# EAGLE design M_C_ext_main (EAGLE 9.6.2)
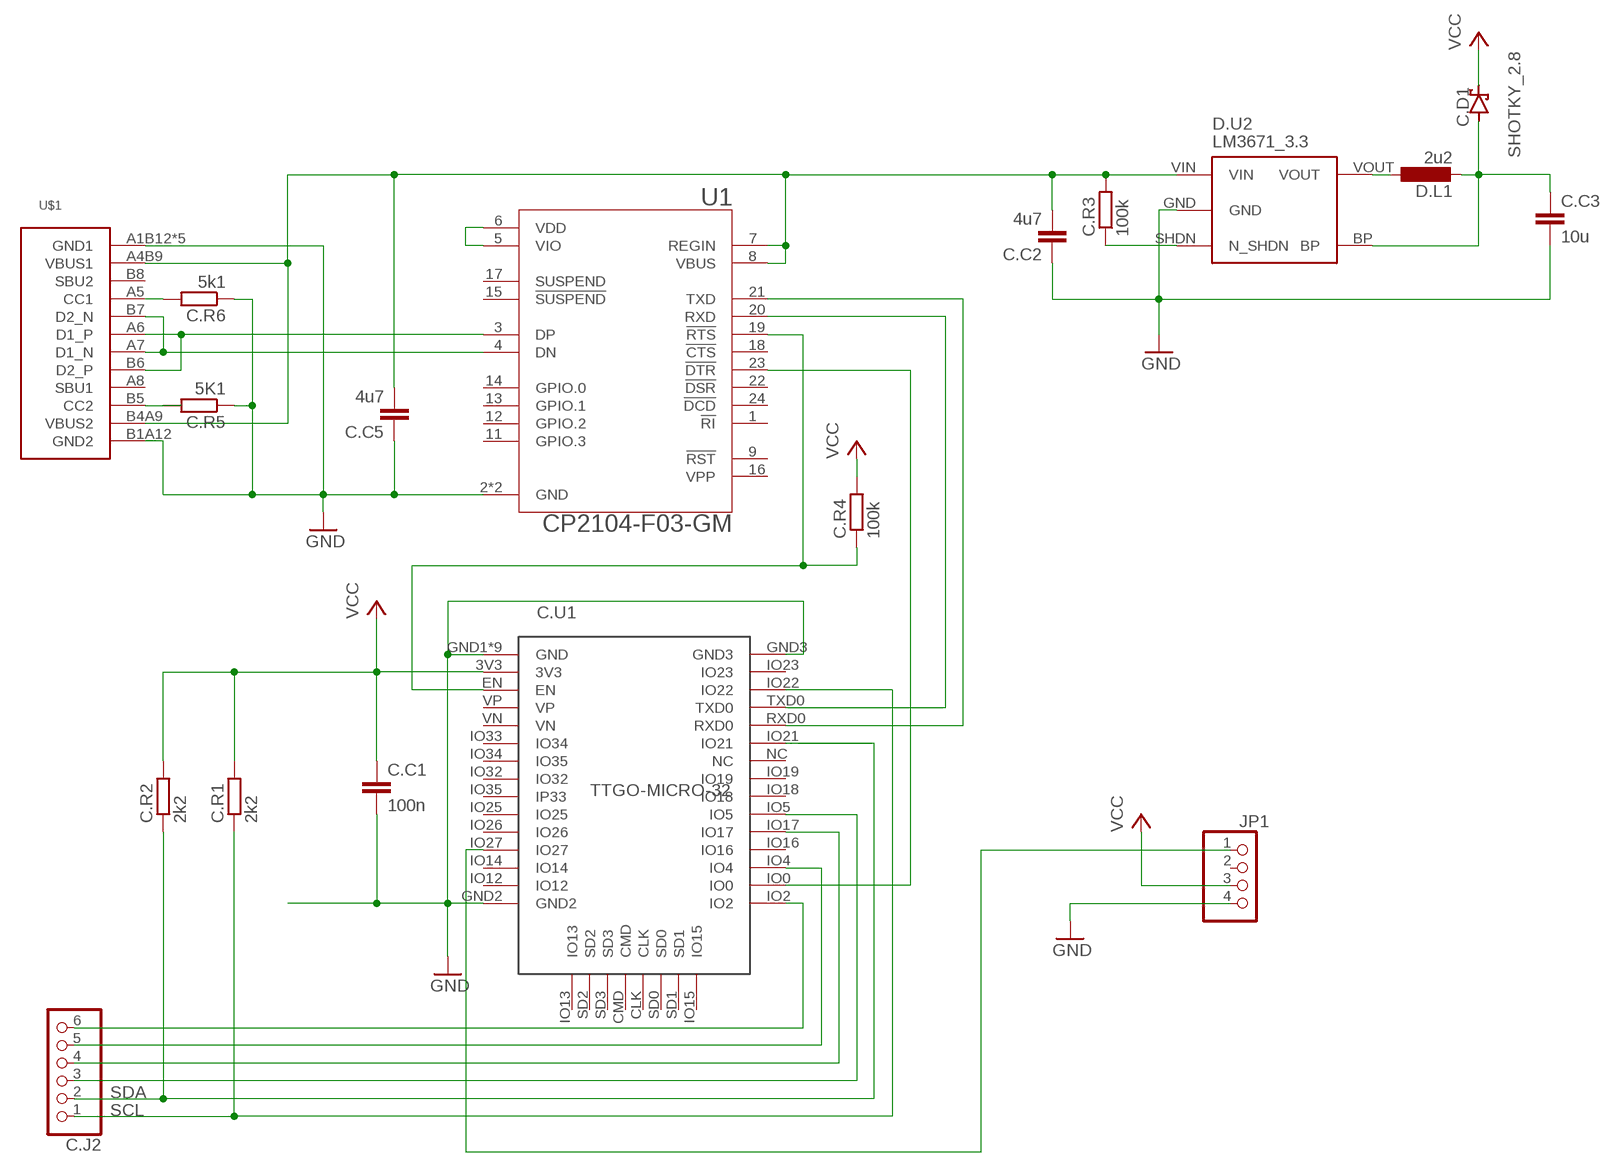
[diagram p0: schematic, sheet 1]

## Parts
C.C1  100n  C-EUC0603  [C0603]
C.C2  4u7  C-EUC0603  [C0603]
C.C3  10u  C-EUC0805  [C0805]
C.C5  4u7  C-EUC0603  [C0603]
C.D1  SHOTKY_2.8  [SHOTKY_2.8]
C.J2  PINHD-1X6  [1X06]
C.R1  2k2  R-EU_R0603  [R0603]
C.R2  2k2  R-EU_R0603  [R0603]
C.R3  100k  R-EU_R0603  [R0603]
C.R4  100k  R-EU_R0603  [R0603]
C.R5  5K1  R-EU_R0603  [R0603]
C.R6  5k1  R-EU_R0603  [R0603]
C.U1  TTGO-MICRO-32  [TTGO-MICRO-32]
D.L1  2u2  L-EUL3230M  [L3230M]
D.U2  LM3671_3.3  STABILISER_APE8865  [SOT32-5]
JP1  PINHD-1X4  [1X04]
U1  CP2104-F03-GM  [QFN50P400X400X80-25N]
U$1  USB-C  [USB-C]

## Nets
GND: C.C1.2 C.C2.1 C.C3.2 C.C5.1 C.R5.1 C.R6.1 C.U1.GND1(GND) C.U1.GND2 C.U1.GND3 C.U1.GND4(GND) C.U1.GND5(GND) C.U1.GND6(GND) C.U1.GND7(GND) C.U1.GND8(GND) C.U1.GND9(GND) C.U1.GND10(GND) C.U1.GND11(GND) D.U2.GND JP1.4 U1.2(GND) U1.25(GND) U$1.A1B12(GND1) U$1.B1A12(GND2) U$1.SH1(GND1) U$1.SH2(GND1) U$1.SH3(GND1) U$1.SH4(GND1)
N$1: U1.4(DN) U$1.A7(D1_N) U$1.B7(D2_N)
N$2: U1.3(DP) U$1.A6(D1_P) U$1.B6(D2_P)
N$3: C.R6.2 U$1.A5(CC1)
N$4: C.R5.2 U$1.B5(CC2)
N$5: C.C3.1 C.D1.A D.L1.2 D.U2.BP
N$6: C.J2.6 C.U1.IO2
N$8: U1.5(VIO) U1.6(VDD)
N$10: D.L1.1 D.U2.VOUT
N$11: C.R3.1 D.U2.SHDN(N_SHDN)
N$12: C.J2.5 C.U1.IO4
N$13: C.J2.4 C.U1.IO17
N$14: C.J2.3 C.U1.IO5
N$15: C.U1.IO27 JP1.1
PROG: C.U1.IO0 U1.23(!DTR)
RESET: C.R4.1 C.U1.EN U1.19(!RTS)
RX: C.U1.TXD0 U1.20(RXD)
SCL: C.J2.1 C.R1.1 C.U1.IO22
SDA: C.J2.2 C.R2.1 C.U1.IO21
TX: C.U1.RXD0 U1.21(TXD)
VCC: C.C1.1 C.D1.K(C) C.R1.2 C.R2.2 C.R4.2 C.U1.3V3 JP1.3
VUSB: C.C2.2 C.C5.2 C.R3.2 D.U2.VIN U1.7(REGIN) U1.8(VBUS) U$1.A4B9(VBUS1) U$1.B4A9(VBUS2)
Unconnected: C.U1.CLK C.U1.CMD C.U1.IO12 C.U1.IO13 C.U1.IO14 C.U1.IO15 C.U1.IO16 C.U1.IO18 C.U1.IO19 C.U1.IO23 C.U1.IO25 C.U1.IO26 C.U1.IO32 C.U1.IO33(IO34) C.U1.IO34(IO35) C.U1.IO35(IP33) C.U1.NC C.U1.SD0 C.U1.SD1 C.U1.SD2 C.U1.SD3 C.U1.VN C.U1.VP JP1.2 U1.1(!RI) U1.9(!RST!) U1.11(GPIO.3) U1.12(GPIO.2) U1.13(GPIO.1) U1.14(GPIO.0) U1.15(!SUSPEND!) U1.16(VPP) U1.17(SUSPEND) U1.18(!CTS) U1.22(!DSR) U1.24(!DCD) U$1.A8(SBU1) U$1.B8(SBU2)

## Library data of the parts
C.C1-C.C3 C.C5 = rcl:C-EU: CAPACITOR, European symbol; SPICEPREFIX: C
C.D1 = hugo:SHOTKY_2.8
C.J2 = pinhead2:PINHD-1X6: PIN HEADER
C.R1-C.R6 = rcl:R-EU_: RESISTOR, European symbol; SPICEPREFIX: R
C.U1 = hugo:TTGO-MICRO-32
D.L1 = rcl:L-EU: INDUCTOR, European symbol; SPICEPREFIX: L
D.U2 = !stavebnice03:STABILISER_APE8865
JP1 = pinhead2:PINHD-1X4: PIN HEADER
U1 = CP2104:CP2104: Silabs CP2104 USB to UART Bridge; AVAILABILITY: Unavailable; DESCRIPTION: USB Bridge, USB to UART USB 2.0 UART Interface 24-QFN (4x4); MF: Silicon Labs; MP: CP2104; PACKAGE: QFN-24 Silicon Labs; PRICE: None
U$1 = hugo:USB-C

## Board
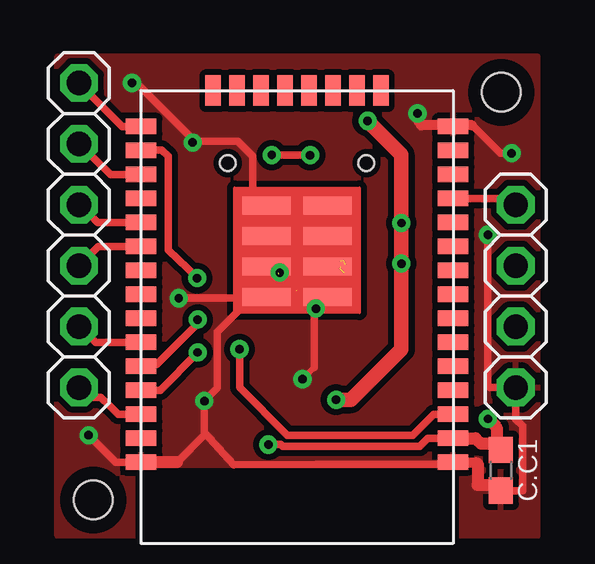
[diagram p1: board, top side]
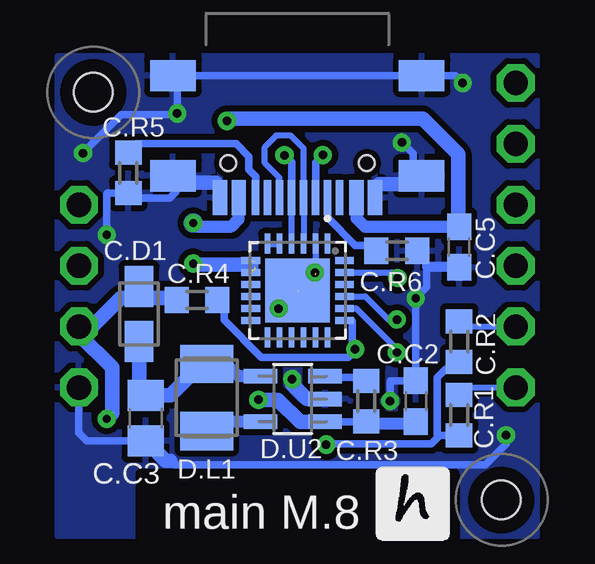
[diagram p2: board, bottom side, seen from below]

No outline drawn. Coordinates in mm, seen from the top.
Copper layers (1*16): Top 0.035mm / dielectric 1.5mm / Bottom 0.035mm
Design rules "default *": minimum track width 10mil, minimum drill 0.35mm, track to track 6mil, track to pad 6mil, pad to pad 6mil, via to via 10mil, smd to smd 10mil, copper to edge 10mil, drill to drill 40mil, minimum pad ring 10mil, minimum via ring 8mil, stop-mask expansion 4mil, vias tented up to drill 0mil, thermal gap 10mil
Holes 1.6 mm at 2,2 19,19
tRestrict: area 18,18 to 20,20; area 1,1 to 3,3
bRestrict: area 1,1 to 3,3; area 18,18 to 20,20

### Footprints (pad centres in the part's own frame; a part is rotated, then mirrored left to right if it is on the bottom)
C0603 = smd 1.1 x 1: 1 -0.85,0; 2 0.85,0
C0805 = smd 1.3 x 1.5: 1 -0.95,0; 2 0.95,0
SHOTKY_2.8 = smd 1.7 x 1.2: A -1.15,0; K 1.15,0
1X06 = drill 1.016 pad 1.575 octagon: 1 -6.35,0; 2 -3.81,0; 3 -1.27,0; 4 1.27,0; 5 3.81,0; 6 6.35,0
R0603 = smd 1 x 1.1: 1 -0.85,0; 2 0.85,0
TTGO-MICRO-32 = smd 1.27 x 0.635: 3V3 -6.5,5; EN -6.5,4; GND1 -6.5,6; GND2 -6.5,-8; GND3 6.5,6; IO0 6.5,-7; IO2 6.5,-8; IO4 6.5,-6; IO5 6.5,-3; IO12 -6.5,-7; IO14 -6.5,-6; IO16 6.5,-5; IO17 6.5,-4; IO18 6.5,-2; IO19 6.5,-1; IO21 6.5,1; IO22 6.5,4; IO23 6.5,5; IO25 -6.5,-3; IO26 -6.5,-4; IO27 -6.5,-5; IO32 -6.5,-1; IO33 -6.5,-2; IO34 -6.5,1; IO35 -6.5,0; NC 6.5,0; RXD0 6.5,2; TXD0 6.5,3; VN -6.5,2; VP -6.5,3 | smd 0.635 x 1.27: CLK 0.5,-9.5; CMD -0.5,-9.5; IO13 -3.5,-9.5; IO15 3.5,-9.5; SD0 1.5,-9.5; SD1 2.5,-9.5; SD2 -2.5,-9.5; SD3 -1.5,-9.5 | smd 2.032 x 0.762: GND4 -1.27,-0.889; GND5 1.27,-0.889; GND6 -1.27,-2.159; GND7 1.27,-2.159; GND8 -1.27,-3.429; GND9 -1.27,-4.699; GND10 1.27,-3.429; GND11 1.27,-4.699
L3230M = smd 1.6 x 2.2: 1 -1.4,0; 2 1.4,0
SOT32-5 = smd 0.6 x 1.4: BP 0.95,1.35; GND 0,-1.35; SHDN 0.95,-1.35; VIN -0.95,-1.35; VOUT -0.95,1.35
1X04 = drill 1.016 pad 1.575 octagon: 1 -3.81,0; 2 -1.27,0; 3 1.27,0; 4 3.81,0
QFN50P400X400X80-25N = smd 0.81 x 0.26: 1 -1.955,1.25; 2 -1.955,0.75; 3 -1.955,0.25; 4 -1.955,-0.25; 5 -1.955,-0.75; 6 -1.955,-1.25; 13 1.955,-1.25; 14 1.955,-0.75; 15 1.955,-0.25; 16 1.955,0.25; 17 1.955,0.75; 18 1.955,1.25 | smd 0.26 x 0.81: 7 -1.25,-1.955; 8 -0.75,-1.955; 9 -0.25,-1.955; 10 0.25,-1.955; 11 0.75,-1.955; 12 1.25,-1.955; 19 1.25,1.955; 20 0.75,1.955; 21 0.25,1.955; 22 -0.25,1.955; 23 -0.75,1.955; 24 -1.25,1.955 | smd 2.68 x 2.68: 25 0,0
USB-C = smd 0.6 x 1.45: A1B12 -3.235,3.825; A4B9 -2.46,3.825; B1A12 3.215,3.825; B4A9 2.44,3.825 | smd 0.3 x 1.45: A5 -1.26,3.825; A6 -0.26,3.825; A7 0.24,3.825; A8 1.24,3.825; B5 1.74,3.825; B6 0.74,3.825; B7 -0.76,3.825; B8 -1.76,3.825 | smd 1.9 x 1.3: SH1 -5.18,2.91; SH2 -5.18,-1.27; SH3 5.18,-1.27; SH4 5.18,2.91 | hole 0.65: 2.88,2.38; -2.9,2.38

### Placement (x,y rotation side)
C.C1  18.98,3.24 270 top
C.C2  5.56,6.12 270 bottom
C.C3  16.82,5.42 270 bottom
C.C5  3.76,12.55 90 bottom
C.D1  17.09,9.75 90 bottom
C.J2  1.4,13.04 90 top
C.R1  3.76,5.53 270 bottom
C.R2  3.76,8.6 270 bottom
C.R3  7.63,6.12 270 bottom
C.R4  14.68,10.34 180 bottom
C.R5  17.54,15.64 90 bottom
C.R6  6.35,12.39 180 bottom
C.U1  10.49,9.58 180 top
D.L1  14.27,6.27 90 bottom
D.U2  10.69,6.21 90 bottom
JP1  19.6,10.5 270 top
U1  10.49,10.74 270 bottom
U$1  10.5,18.43 180 bottom

### Tracks (layer width: path | path; a pad name or v marks a point on that pad's centre or on a via)
GND  (via drill 0.35)  (2 unrouted)
  Top 0.254: 18.17,17.24 17.79,17.63 | 9.17,10.21 9.42,10.46 9.8,10.84 10.24,10.84 10.47,10.84 11.1,10.21 | v10.72,7.04 11.2,7.52
  Top 0.305: 15.65,17.63 15.51,17.77 v15.51,18.12 15.51,17.97 | 16.94,17.63 C.U1.GND2 | v6.63,6.13 6.63,4.7 5.5,3.57 | C.U1.GND3 2.93,3.57 v1.8,4.7 | 6.23,17 v6.14,16.91 | v6.14,16.91 6.14,17.04 3.81,19.38 v3.61,19.39 | C.C1.2 19.89,2.39 19.89,5.08 19.6,5.37 JP1.4 18.51,6.69 18.44,6.76 v18.44,13.06 | 17.53,3.58 C.U1.GND1 | C.U1.GND1 16.88,3.46 16.85,3.46 16.75,3.57 | v6.63,6.13 6.63,4.81 7.86,3.47 11.29,3.48 16.89,3.48 C.U1.GND1 | v6.14,16.91 6.21,16.97 8.01,16.97 8.65,16.33 8.65,14.79 9.73,13.71 9.73,12.76 9.73,11.57 | 9.73,11.57 9.73,11.43 9.73,10.13 11.2,11.6 11.2,7.52 | 12.32,10.26 11.15,10.26 11.1,10.21 9.17,10.21 | 9.42,10.46 C.U1.GND5 | 9.73,11.57 7.17,9.01 7.17,6.67 v6.63,6.13 | v19.43,16.46 18.95,16.46 17.79,17.63 | v5.56,10.41 9.81,10.41 10.24,10.84 | 18.01,3.52 17.95,3.58
  Top 0.406: 15.65,17.63 16.94,17.63 17.79,17.63 | C.U1.GND1 17.95,3.58
  Top 0.508: 5.5,3.57 C.U1.GND3 | C.C1.2 18.75,2.62 18.01,2.62 18.01,3.52 | C.U1.GND1 16.95,3.61 | C.U1.GND10 9.48,13.01 9.73,12.76 | C.U1.GND7 9.42,11.73 9.73,11.43
  Bottom 0.254: 15.51,15.57 U$1.SH4 | D.U2.GND 9.38,6.24 | U1.2 9.74,11.48 v9.77,11.48 9.75,11.46 9.75,11.41 | C.C5.1 3.82,11.73 | 5.1,11.73 C.R6.1 5.52,12.31 | U1.25 10.13,11.1 9.86,11.1
  Bottom 0.305: 15.49,18.12 v15.51,18.12 | U$1.A1B12 7.26,15.01 7.24,15.01 | 7.09,15.18 7.09,15.01 7.24,15.01 | 7.24,15.01 7.24,14.82 | v6.14,16.91 5.68,16.44 5.68,15.4 | v15.51,18.12 15.51,19.65 U$1.SH3 U$1.SH2 3.92,19.7 v3.61,19.39 | 15.32,15.52 U$1.SH4 | U$1.SH4 15.29,15.52 15.01,15.24 | U$1.SH1 5.76,15.18 | 10.7,10.94 U1.25 | 9.71,11.46 10.46,10.71 | v15.51,18.12 15.56,18.07 17.82,18.07 v19.43,16.46 | C.C5.1 3.72,11.7 3.65,11.63 | U$1.B1A12 13.71,15.05 13.9,15.24 | v18.44,13.06 18.44,14.76 18.41,14.73 18.41,14.79 C.R5.1 17.34,14.59 15.81,14.59 15.56,14.84 U$1.SH4 | 9.74,11.22 9.86,11.1 | v6.63,6.13 6.63,6.97 C.C2.1 v5.57,10.41 v5.56,10.41 5.1,10.88 5.1,11.73 | C.C3.2 19.27,4.46 19.6,4.8 JP1.4 | 15.8,3.63 15.64,3.47 2.67,3.47 1.8,4.34 v1.8,4.7
  Bottom 0.406: 5.1,11.73 3.82,11.73
  Bottom 0.508: U1.25 10.53,10.74 11.1,10.21
  Bottom 0.61: 13.9,15.24 15.01,15.24 | 5.76,15.18 7.09,15.18 | D.U2.GND 10.1,6.21 10.72,6.82 v10.72,7.04 | C.C3.2 15.98,3.63 15.8,3.63
  other vias: 11.28,9.98
  pour Top (isolate 0.254): 0.5,0.5 0.5,20.5 20.5,20.5 20.5,0.5
  pour Bottom (isolate 0.254): 0.5,20.5 20.5,20.5 20.5,0.5 0.5,0.5
N$1  (via drill 0.35)
  Top 0.305: v11.04,16.38 v11.03,16.38 v9.43,16.38
  Bottom 0.254: U$1.A7 U1.4
  Bottom 0.305: U$1.A7 10.74,16.08 v11.04,16.38 | v9.43,16.38 9.74,16.08 U$1.B7
N$2
  Bottom 0.254: U1.3 10.24,12.7 U$1.A6 10.24,16.66 10.78,17.19 11.38,17.19 11.85,16.72 11.85,16.04 11.25,15.44 11.25,14.61 U$1.B6
N$3
  Bottom 0.254: 7.52,12.61 C.R6.2
  Bottom 0.305: U$1.A5 9.24,13.77 8.09,12.62 7.43,12.62 C.R6.2
N$4
  Bottom 0.305: U$1.B5 12.24,15.49 12.51,15.77 12.51,16.32 13.05,16.86 17.2,16.86 17.54,16.52 C.R5.2
N$5
  Bottom 0.305: 17.07,8.38 17.09,8.4 C.D1.A
  Bottom 0.508: C.C3.1 16.84,6.4 | 17.2,8.5 17.2,8.1 17.08,8.21 | D.L1.2 13.46,7.67 12.95,7.17 D.U2.BP
  Bottom 0.61: 17.07,8.38 17.2,8.5 | C.D1.A 17.09,6.64 C.C3.1 15.8,6.37 14.49,7.67 D.L1.2
N$6
  Top 0.305: C.U1.IO2 3.21,17.58 C.J2.6
N$8
  Bottom 0.254: U1.6 11.71,12.67 11.37,12.67 11.27,12.67 U1.5
N$10
  Bottom 0.305: 12.07,5.26 D.U2.VOUT | D.L1.1 13.87,5.27
  Bottom 0.508: D.U2.VOUT 12.05,5.27 13.87,5.27
N$11
  Bottom 0.305: D.U2.SHDN 9.28,7.1 7.76,7.1 C.R3.1
N$12
  Top 0.305: C.U1.IO4 2.72,15.58 C.J2.5
N$13
  Top 0.305: C.U1.IO17 2.18,13.58 C.J2.4
N$14
  Top 0.305: C.U1.IO5 2.21,12.58 C.J2.3
N$15
  Top 0.305: C.U1.IO27 19.33,14.58 JP1.1
PROG  (via drill 0.35)
  Top 0.305: C.U1.IO0 4.32,16.58 4.33,16.59 4.86,16.59 5.12,16.33 5.12,12.42 6.32,11.27 v6.33,11.25
  Bottom 0.254: U1.23 6.56,11.49 v6.33,11.25
RESET  (via drill 0.35)
  Top 0.305: C.U1.EN 16.19,5.58 15.31,4.7 10.08,4.7 8.09,6.68 v8.09,8.29
  Bottom 0.254: U1.19 8.51,9.46 8.22,9.46
  Bottom 0.305: 8.22,9.46 8.22,8.41 v8.09,8.29 8.09,8.23 8.38,7.95 12,7.95 13.55,9.5 13.55,10.06 C.R4.1
RX  (via drill 0.35)
  Top 0.305: C.U1.TXD0 4.01,6.56 4.79,6.56 v6.35,8.15
  Bottom 0.254: U1.20 8.05,9.99 6.35,8.29 v6.35,8.15
SCL
  Top 0.305: C.U1.IO22 3.04,5.58 2.69,5.93 2.31,6.28 1.81,6.28 C.J2.1
  Bottom 0.254: C.R1.1 3.45,6.69 C.J2.1
SDA
  Top 0.305: C.U1.IO21 2.1,8.58 C.J2.2
  Bottom 0.254: C.R2.1 3.76,9.23 C.J2.2
TX  (via drill 0.35)
  Top 0.305: C.U1.RXD0 4.06,7.65 4.65,7.65 6.35,9.35 v6.35,9.52
  Bottom 0.254: U1.21 7.67,10.49 6.71,9.52 v6.35,9.52
VCC  (via drill 0.35)
  Top 0.305: C.U1.3V3 15.93,4.58 15.6,4.24 9.89,4.24 9.82,4.31 v9.3,4.31
  Top 0.406: 17,4.56 C.U1.3V3 | 18.42,5.38 v18.44,5.38
  Top 0.508: 18.44,5.35 v18.44,5.38 18.8,5.02 18.8,4.26 C.C1.1 18.73,4.34 18.16,4.34 17.92,4.58 C.U1.3V3
  Bottom 0.254: 3.93,4.36 C.R1.2 | 3.96,7.75 C.R2.2
  Bottom 0.305: C.R1.2 4.57,4.68 | 4.57,4.68 4.67,4.68 4.67,7.11 4.33,7.45 4.06,7.45 C.R2.2 | 4.57,4.68 4.92,4.34 9.27,4.34 v9.3,4.31 | C.R4.2 15.42,10.22 | C.R4.2 15.53,10.29 | C.R4.2 15.77,10.58 | C.R4.2 15.68,10.34 15.81,10.46 | C.R4.2 15.69,10.49
  Bottom 0.61: C.R4.2 15.61,10.41 16.91,10.41 17.09,10.6 C.D1.K 17.09,10.7 17.37,10.42 17.85,10.42 19.04,9.23 JP1.3 19.6,8.91 18.21,7.52 18.21,5.61 v18.44,5.38
VUSB  (via drill 0.35)  (4 unrouted)
  Top 0.61: v13.43,17.81 13.43,17.79 14.83,16.39 v14.83,13.55 v14.83,11.86 14.83,8.28 12.73,6.18 v12.12,6.18
  Bottom 0.254: 12.26,11.66 12.89,11.66
  Bottom 0.305: 12.28,11.71 12.28,11.95 | D.U2.VIN 7.64,5.26 C.R3.2
  Bottom 0.508: C.C5.2 7.68,13.39 8.04,13.75 U$1.A4B9 | v14.83,13.55 14.83,13.54 14.71,13.41 13.24,13.41 12.94,13.71 U$1.B4A9 | C.C2.2 5.64,5.19 7.55,5.19 C.R3.2
  Bottom 0.61: v14.83,13.55 14.84,13.56 | v13.43,17.81 13.34,17.9 5.28,17.9 3.8,16.42 3.8,13.72 C.C5.2 | v14.83,11.86 14.79,11.81 12.5,11.81 | D.U2.VIN 9.35,5.25 10.38,5.25 11.31,6.18 v12.12,6.18
  Bottom 0.813: v14.83,13.55 v14.84,13.55

### Text on the board
bPlace: main M.8